# EAGLE design power-distribution (EAGLE 8.6.1)
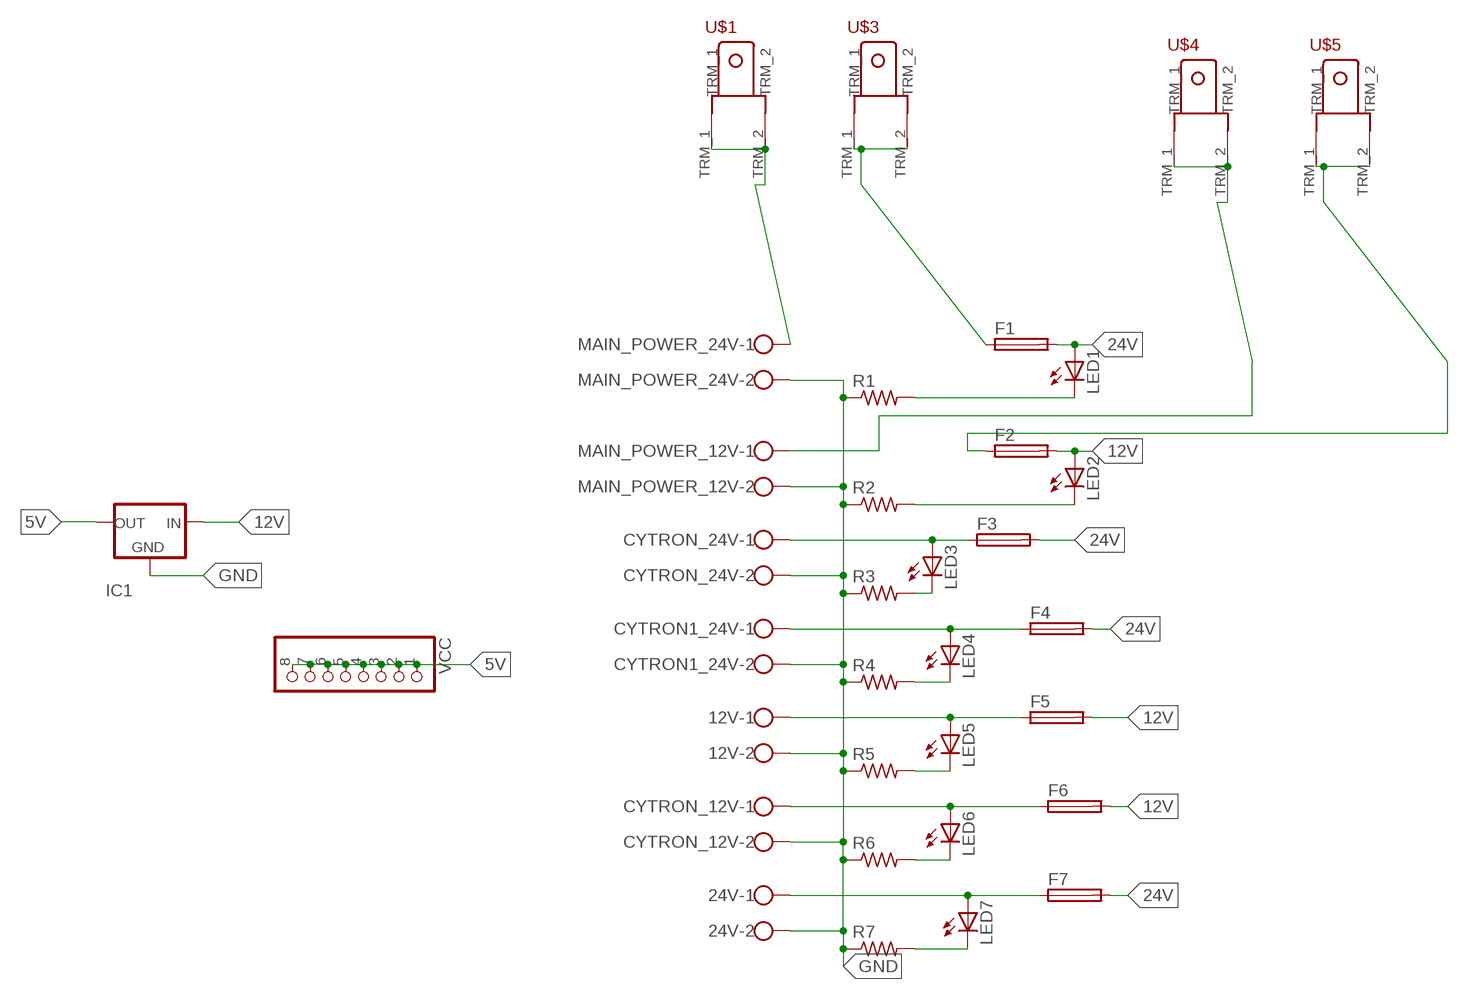
[diagram p0: schematic, sheet 1]

## Parts
12V  W237-113  [W237-113]
24V  W237-113  [W237-113]
CYTRON1_24V  W237-113  [W237-113]
CYTRON_12V  W237-113  [W237-113]
CYTRON_24V  W237-113  [W237-113]
F1  SH22,5A  [SH22,5A]
F2  SH22,5A  [SH22,5A]
F3  SH22,5A  [SH22,5A]
F4  SH22,5A  [SH22,5A]
F5  SH22,5A  [SH22,5A]
F6  SH22,5A  [SH22,5A]
F7  SH22,5A  [SH22,5A]
IC1  79XX-TO3  [TO3-79]
LED1  LED5MM  [LED5MM]
LED2  LED5MM  [LED5MM]
LED3  LED3MM  [LED3MM]
LED4  LED3MM  [LED3MM]
LED5  LED3MM  [LED3MM]
LED6  LED3MM  [LED3MM]
LED7  LED3MM  [LED3MM]
MAIN_POWER_12V  W237-113  [W237-113]
MAIN_POWER_24V  W237-113  [W237-113]
R1  R-US_0204/5  [0204/5]
R2  R-US_0207/12  [0207/12]
R3  R-US_0204/5  [0204/5]
R4  R-US_0204/5  [0204/5]
R5  R-US_0207/10  [0207/10]
R6  R-US_0204/5  [0204/5]
R7  R-US_0204/5  [0204/5]
U$1  TERMINAL_EDITED  [TERMINAL_EDITED]
U$3  TERMINAL_EDITED  [TERMINAL_EDITED]
U$4  TERMINAL_EDITED  [TERMINAL_EDITED]
U$5  TERMINAL_EDITED  [TERMINAL_EDITED]
VCC  PINHD-1X8  [1X08]

## Nets
5V: IC1.1(OUT) VCC.1 VCC.2 VCC.3 VCC.4 VCC.5 VCC.6 VCC.7 VCC.8
12V: F2.2 F5.2 F6.2 IC1.3(IN) LED2.A
24V: F1.2 F3.2 F4.2 F7.2 LED1.A
GND: 12V.2 24V.2 CYTRON1_24V.2 CYTRON_12V.2 CYTRON_24V.2 IC1.2(GND) MAIN_POWER_12V.2 MAIN_POWER_24V.2 R1.1 R2.1 R3.1 R4.1 R5.1 R6.1 R7.1
N$1: CYTRON_12V.1 F6.1 LED6.A
N$2: LED1.K(C) R1.2
N$3: MAIN_POWER_24V.1 U$1.TRM_1 U$1.TRM_2
N$4: LED2.K(C) R2.2
N$5: MAIN_POWER_12V.1 U$4.TRM_1 U$4.TRM_2
N$6: 24V.1 F7.1 LED7.A
N$7: CYTRON_24V.1 F3.1 LED3.A
N$8: LED3.K(C) R3.2
N$9: CYTRON1_24V.1 F4.1 LED4.A
N$10: LED4.K(C) R4.2
N$11: 12V.1 F5.1 LED5.A
N$12: LED5.K(C) R5.2
N$13: F1.1 U$3.TRM_1 U$3.TRM_2
N$14: F2.1 U$5.TRM_1 U$5.TRM_2
N$15: LED6.K(C) R6.2
N$16: LED7.K(C) R7.2

## Library data of the parts
12V 24V CYTRON1_24V CYTRON_12V CYTRON_24V MAIN_POWER_12V MAIN_POWER_24V = con-wago-500:W237-113: WAGO SCREW CLAMP; OC_FARNELL: unknown; OC_NEWARK: unknown
F1-F7 = fuse:SH22,5A: FUSE HOLDER grid 22,5mm, isolated cap OGN0031 8201, Schurter (Buerklin); MPN: 0031.7701.11; OC_FARNELL: unknown; OC_NEWARK: 04F1224
IC1 = v-reg:79XX-TO3: VOLTAGE REGULATOR
LED1-LED7 = led:LED: LED OSRAM: - CHIPLED LG R971, LG N971, LY N971, LG Q971, LY Q971, LO R971, LY R971 LH N974, LH R974 LS Q976, LO Q976, LY Q976 LO Q996 - Hyper CHIPLED LW Q18S LB Q993, LB Q99A, LB R99A - SideLED LS A670, LO A670, LY A670, LG A670, LP A670 LB A673, LV A673, LT A673, LW A673 LH A674 LY A675 LS A676, LA A676, LO A676, LY A676, LW A676 LS A679, LY A679, LG A679 - Hyper Micro SIDELED® LS Y876, LA Y876, LO Y876, LY Y876 LT Y87S - SmartLED LW L88C, LW L88S LB L89C, LB L89S, LG L890 LS L89K, LO L89K, LY L89K LS L896, LA L896, LO L896, LY L896 - TOPLED LS T670, LO T670, LY T670, LG T670, LP T670 LSG T670, LSP T670, LSY T670, LOP T670, LYG T670 LG T671, LOG T671, LSG T671 LB T673, LV T673, LT T673, LW T673 LH T674 LS T676, LA T676, LO T676, LY T676, LB T676, LH T676, LSB T676, LW T676 LB T67C, LV T67C, LT T67C, LS T67K, LO T67K, LY T67K, LW E67C LS E67B, LA E67B, LO E67B, LY E67B, LB E67C, LV E67C, LT E67C LW T67C LS T679, LY T679, LG T679 LS T770, LO T770, LY T770, LG T770, LP T770 LB T773, LV T773, LT T773, LW T773 LH T774 LS E675, LA E675, LY E675, LS T675 LS T776, LA T776, LO T776, LY T776, LB T776 LHGB T686 LT T68C, LB T68C - Hyper Mini TOPLED® LB M676 - Mini TOPLED Santana® LG M470 LS M47K, LO M47K, LY M47K Source: http://www.osram.convergy.de LUXEON: - LUMILED® LXK2-PW12-R00, LXK2-PW12-S00, LXK2-PW14-U00, LXK2-PW14-V00 LXK2-PM12-R00, LXK2-PM12-S00, LXK2-PM14-U00 LXK2-PE12-Q00, LXK2-PE12-R00, LXK2-PE12-S00, LXK2-PE14-T00, LXK2-PE14-U00 LXK2-PB12-K00, LXK2-PB12-L00, LXK2-PB12-M00, LXK2-PB14-N00, LXK2-PB14-P00, LXK2-PB14-Q00 LXK2-PR12-L00, LXK2-PR12-M00, LXK2-PR14-Q00, LXK2-PR14-R00 LXK2-PD12-Q00, LXK2-PD12-R00, LXK2-PD12-S00 LXK2-PH12-R00, LXK2-PH12-S00 LXK2-PL12-P00, LXK2-PL12-Q00, LXK2-PL12-R00 Source: www.luxeon.com KINGBRIGHT: KA-3528ASYC Source: www.kingbright.com
R1-R7 = rcl:R-US_: RESISTOR, American symbol; SPICEPREFIX: R
U$1 U$3-U$5 = 1-ROV-Components:TERMINAL_EDITED
VCC = pinhead:PINHD-1X8: PIN HEADER

## Board
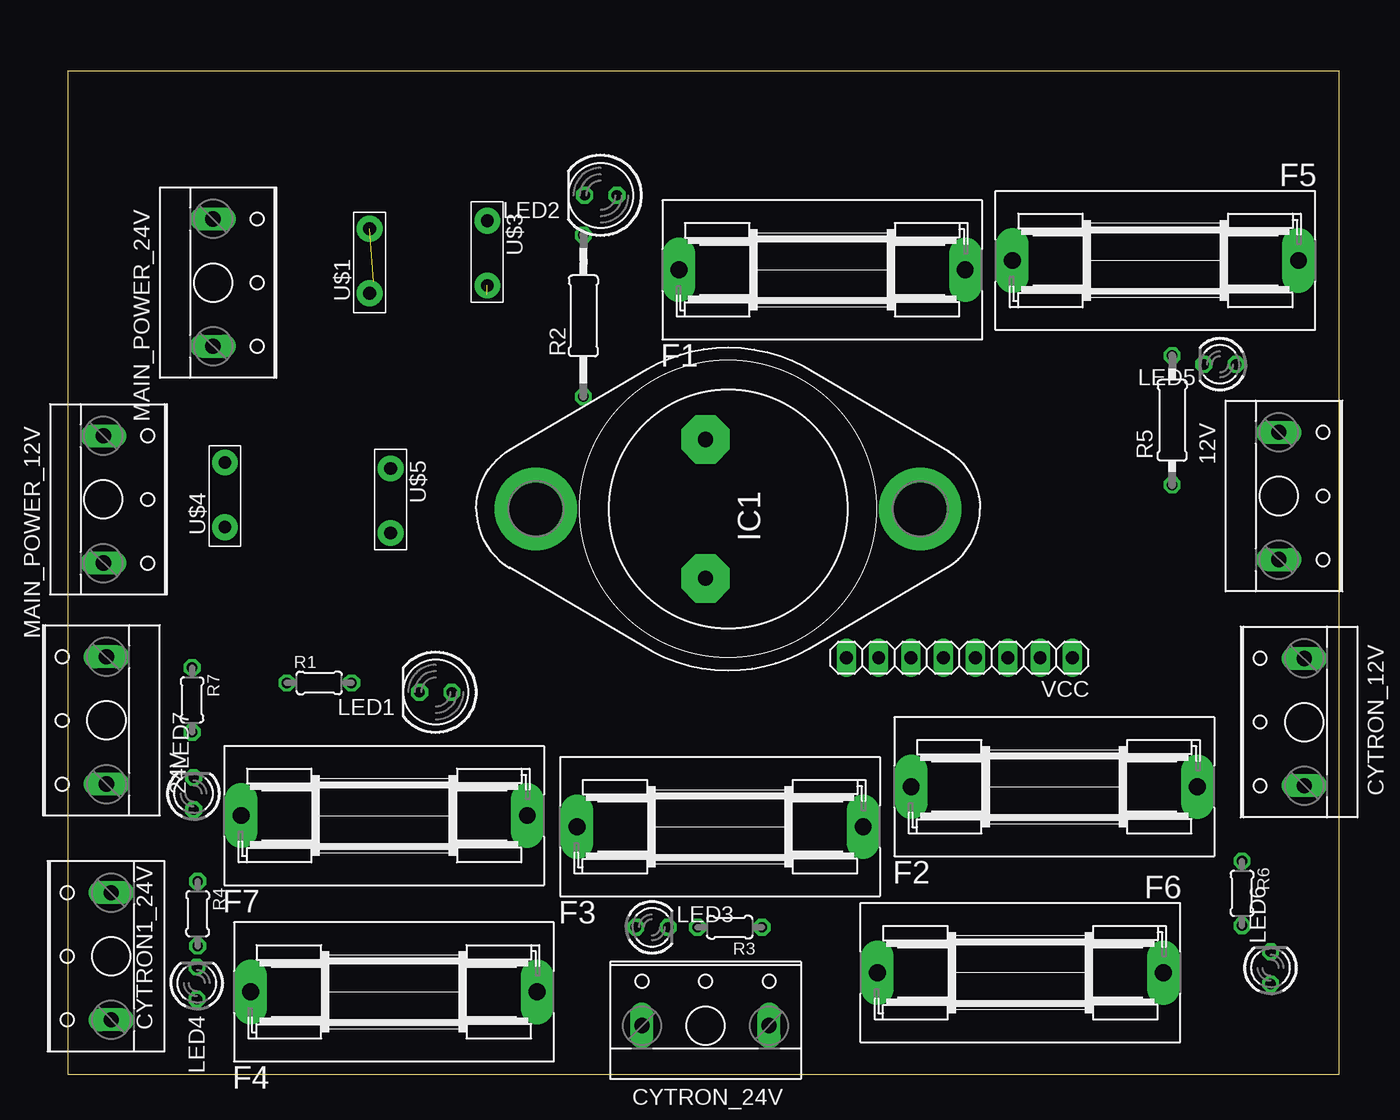
[diagram p1: board, top side]
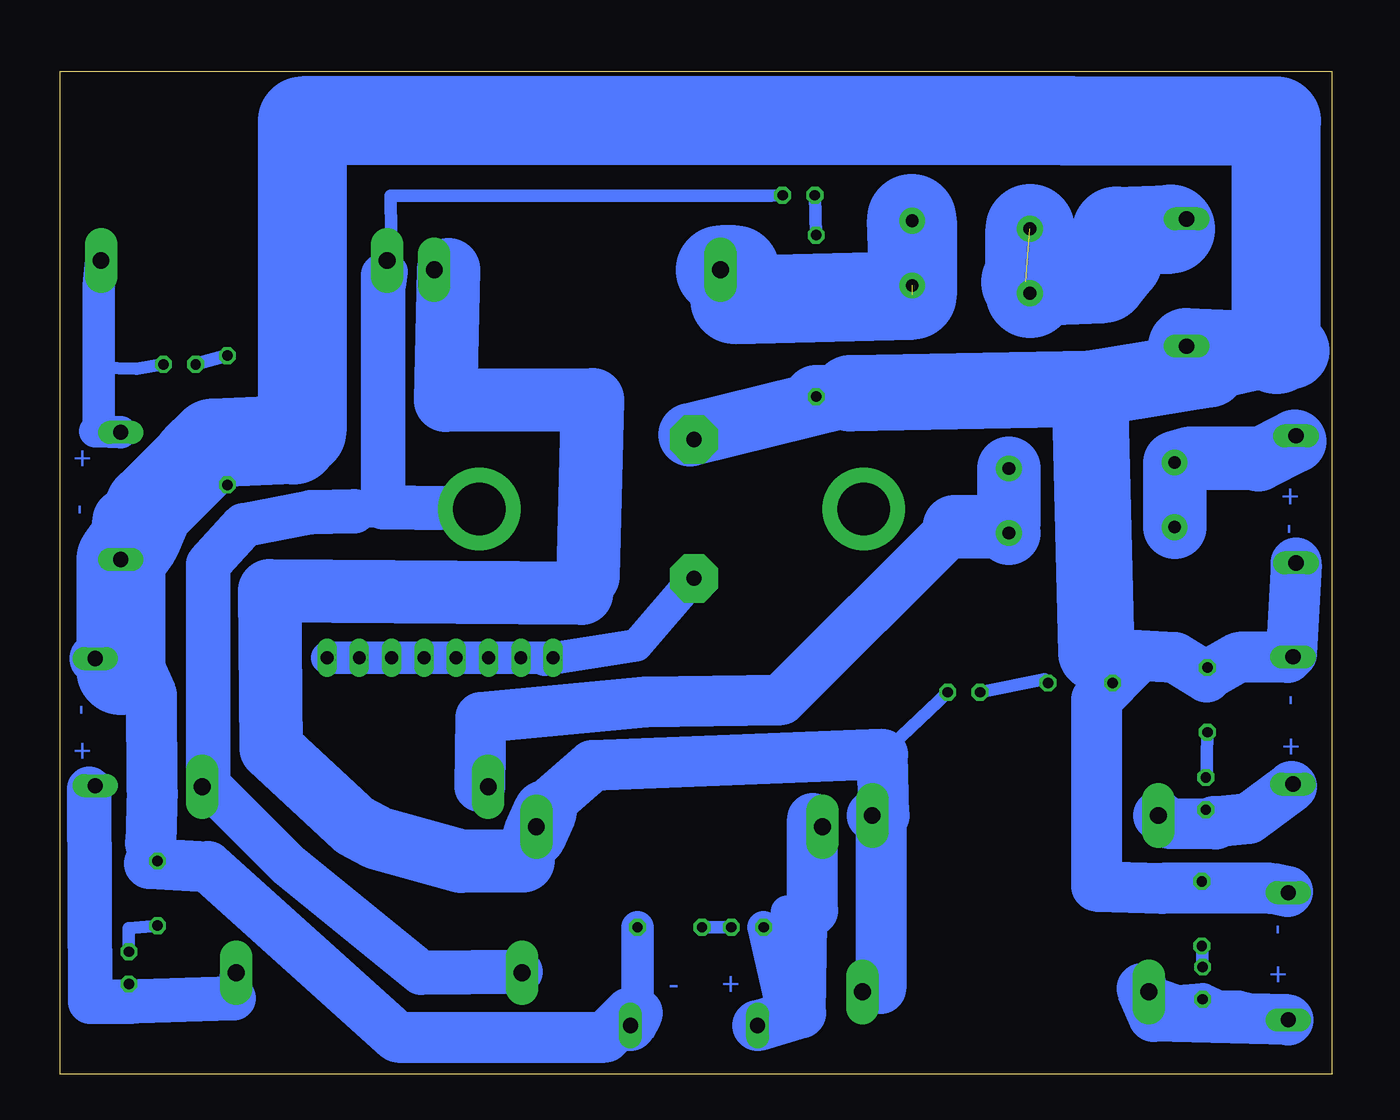
[diagram p2: board, bottom side, seen from below]

Size 100 x 78.84 mm. Coordinates in mm from the lower left corner, seen from the top.
Outline: 0,0 100,0 100,78.84 0,78.84 0,0
Copper layers (1*16): Top 0.035mm / dielectric 1.5mm / Bottom 0.035mm
Design rules "default *": minimum track width 1mm, minimum drill 1mm, track to track 0.6mm, track to pad 0.6mm, pad to pad 6mil, via to via 6mil, smd to smd 6mil, copper to edge 0.6mm, drill to drill 6mil, minimum pad ring 10mil, minimum via ring 8mil, stop-mask expansion 4mil, vias tented up to drill 0mil, thermal gap 10mil

### Footprints (pad centres in the part's own frame; a part is rotated, then mirrored left to right if it is on the bottom)
W237-113 = drill 1.194 long: 1 -5,-1.27; 2 5,-1.27
SH22,5A = drill 1.321 pad 2.54 long: 1 -11.252,0; 2 11.252,0
TO3-79 = drill 1.194 pad 3.81 octagon: 1 -1.778,-5.461; 2 -1.778,5.461 | drill 4.115 pad 6.477: 3 15.113,0; 3@ -15.113,0
LED5MM = drill 0.813 octagon: A -1.27,0; K 1.27,0
LED3MM = drill 0.813 octagon: A -1.27,0; K 1.27,0
0204/5 = drill 0.813 octagon: 1 -2.54,0; 2 2.54,0
0207/12 = drill 0.813 octagon: 1 -6.35,0; 2 6.35,0
0207/10 = drill 0.813 octagon: 1 -5.08,0; 2 5.08,0
TERMINAL_EDITED = drill 1 pad 2.032: TRM_1 -2.54,0; TRM_2 2.54,0
1X08 = drill 1.016 long: 1 -8.89,0; 2 -6.35,0; 3 -3.81,0; 4 -1.27,0; 5 1.27,0; 6 3.81,0; 7 6.35,0; 8 8.89,0

### Placement (x,y rotation side)
12V  96.52,45.45 270 top
24V  1.78,27.8 90 top
CYTRON1_24V  2.16,9.25 90 top
CYTRON_12V  96,27.67 90 top
CYTRON_24V  50.16,5.08 0 top
F1  59.34,63.23 0 top
F2  77.6,22.59 0 top
F3  51.31,19.45 0 top
F4  25.65,6.46 0 top
F5  85.55,63.96 180 top
F6  74.93,7.97 180 top
F7  24.89,20.32 0 top
IC1  51.94,44.43 0 top
LED1  28.94,30.02 180 top
LED2  41.93,69.09 180 top
LED3  45.96,11.54 0 top
LED4  10.16,7.14 90 top
LED5  90.62,55.8 180 top
LED6  94.61,8.35 90 top
LED7  9.91,22.05 90 top
MAIN_POWER_12V  4.08,45.18 270 top
MAIN_POWER_24V  12.7,62.23 270 top
R1  19.78,30.75 0 top
R2  40.56,59.61 90 top
R3  52.07,11.54 180 top
R4  10.22,12.61 270 top
R5  86.87,51.4 90 top
R6  92.36,14.21 270 top
R7  9.78,29.42 270 top
U$1  23.75,63.92 90 top
U$3  33,64.54 270 top
U$4  12.37,45.54 90 top
U$5  25.39,45.07 270 top
VCC  70.14,32.73 180 top

### Tracks (layer width: path | path; a pad name or v marks a point on that pad's centre or on a via)
5V
  Bottom 1: 61.91,32.56 VCC.8
  Bottom 2.54: VCC.8 VCC.7 VCC.6 VCC.5 VCC.4 VCC.3 VCC.2 VCC.1 | IC1.1 54.67,33.7 61.91,32.56
12V
  Bottom 1: 63.82,8.03 F6.2 | 88.22,22.59 F2.2 88.39,23.16 | LED2.A 44.1,69.04 74.04,69.04 73.94,63.13 | 74.12,61.96 F5.2 | 66.94,44.23 IC1.3
  Bottom 2.54: 74.12,61.96 73.94,63.13 74.63,62.82 | 66.94,44.23 76.88,44.26
  Bottom 3.5: 63.82,8.03 71.61,7.95 82.09,16.46 88.22,22.59 | 74.63,62.82 74.63,44.55 IC1.3 | 88.39,23.16 88.39,40.08 85.57,43.16 80.33,44.16 76.88,44.26
24V
  Bottom 1: 35.34,25.13 LED1.A | 35.47,21 36.51,21 F7.2 | 61.55,21.27 F3.2 61.87,20.64 | 69.45,63.23 F1.2
  Bottom 2.54: 35.47,6.71 F4.2 | 62.72,18.78 63.63,16.78
  Bottom 4: F7.2 35.21,20.32 35.34,25.13 58.18,24.26 61.55,21.27 | 35.47,21 35.47,6.71
  Bottom 5: 69.45,63.23 69.71,52.97 58.13,53.01 58.52,39.13 59.87,37.9 59,37.79 83.53,38.01 83.42,25.62 76.85,19.54 75,18.54 68.47,16.75 63.63,16.78 | 61.87,20.64 62.72,18.78
GND
  Bottom 1: 93.73,21.95 92.79,22.4 | 92.92,18.14 R6.1 92.98,16.56 | 3.49,14.34 CYTRON1_24V.2 | 18.51,33.13 R1.1 15.56,32.43 | 9.84,31.21 R7.1 9.53,31.53 | 3.17,33.07 24V.2 3.49,32.75
  Bottom 1.016: R5.1 89.01,48.46 89.01,48.5
  Bottom 1.27: R4.1 12.79,15.14 13.34,14.61
  Bottom 2.54: 54.61,4.81 R3.1 | 55.24,4.81 CYTRON_24V.2 | 50.48,50.26 IC1.2 | 37.86,53.51 R2.1
  Bottom 4: 54.61,4.81 CYTRON_24V.2 | 92.92,18.14 92.79,22.4 92.84,29.81 95,34.61 95,32.93 CYTRON_12V.2 | 55.24,4.81 57.15,2.91 73.47,2.91 88.38,16.3 92.98,16.56 | 3.49,14.34 4.76,14.61 13.34,14.61 18.51,14.78 18.51,29.43 15.56,32.43 | 9.84,31.21 12.38,32.75 18.51,33.13 | MAIN_POWER_12V.2 3.17,33.07 | 9.53,31.53 7.3,32.75 3.49,32.75
  Bottom 5: R2.1 38.37,53.26 50.48,50.26 | 9.67,55.4 3.17,56.88 4.35,56.95 | 81,50.54 81.68,49.86 | 21,74.92 24.23,74.95 20.23,74.95 | 95,43.54 12V.2 | 95.25,31.72 95,34.61
  Bottom 6: 37.86,53.51 19.02,53.89 | 19.02,53.89 9.67,55.4 | 3.17,56.88 MAIN_POWER_24V.2 | 19.02,53.89 18.51,33.13
  Bottom 7: 81,50.54 80.98,53.7 80.98,74.95 20.23,74.95 | 81.68,49.86 87.98,49.61 89.34,48.24 89.01,48.5 92.97,44.54 93,44.54 94,42.2 12V.2 95.25,31.72 | 4.35,56.95 4.35,74.92 21,74.92
N$1
  Bottom 1: 95.12,5.7 LED6.A 94.49,5.7 | 97.75,22.41 97.87,22.67
  Bottom 2.54: 86.36,5.95 F6.1 | 97.87,22.67 CYTRON_12V.1
  Bottom 3.5: 86.36,5.95 95.12,5.7 | 97.75,22.41 97.66,5.7 95.12,5.7 | 94.49,5.7 95.12,5.7
N$2
  Bottom 1: R1.2 22.59,31.02 LED1.K
N$3  (1 unrouted)
  Bottom 1: 12.7,66.42 MAIN_POWER_24V.1
  Bottom 5: 16.81,64 16.94,66.28
  Bottom 7: 16.94,66.28 12.7,66.42 | 24.07,62.28 18,62.54 16.81,64 | U$1.TRM_1 U$1.TRM_2
N$4
  Bottom 1: LED2.K R2.2
N$5
  Bottom 4: 12.05,48.29 6.13,48.44 | MAIN_POWER_12V.1 2.9,49.77
  Bottom 5: U$4.TRM_1 U$4.TRM_2 11.14,48.44 6.13,48.44 5.76,48.31 2.9,49.77
N$6
  Bottom 1: 9.16,19.67 LED7.A 9.27,19.84 | 3.17,22.59 24V.1
  Bottom 4: 9.16,19.67 12.7,19.7 F7.1 | 3.17,22.59 6.54,20.1 9.27,19.84
N$7
  Bottom 1: 40.83,20.08 F3.1 | 42.86,12.75 LED3.A
  Bottom 2.54: LED3.A 43.18,4.81 CYTRON_24V.1 | 42.86,12.75 40.83,12.88
  Bottom 4: CYTRON_24V.1 41.78,4.81 41.66,11.92 | 40.83,12.88 40.83,20.08
N$8
  Bottom 1: R3.2 LED3.K
N$9
  Bottom 1: 14.92,6.71 F4.1
  Bottom 2.54: 14.92,6.71 12.06,5.71 LED4.A 8.84,5.3 7.3,5.3 3.49,4.49 CYTRON1_24V.1
  Bottom 4: CYTRON1_24V.1 14,4.54 14.92,6.71
N$10
  Bottom 1: R4.2 LED4.K
N$11
  Bottom 1: 97.25,50.53 96.9,55.53 94,55.44 LED5.A | 96.98,50.85 12V.1
  Bottom 2.54: 97.25,50.53 12V.1 | 96.98,50.85 96.98,61.96 F5.1
N$12
  Bottom 1.016: R5.2 LED5.K
N$13  (1 unrouted)
  Bottom 1: 46.91,63.23 46.91,62.96
  Bottom 5: 46.91,62.96 46.94,60.88
  Bottom 7: 32.99,61.24 32.99,65.04 33.05,67.28 | 46.94,60.88 32.99,61.24 | 46.91,63.23 F1.1 | U$3.TRM_1 33,61.26 32.99,61.24
N$14
  Bottom 2.54: 66.99,22.59 F2.1
  Bottom 4: 66.99,22.59 66.91,28.05 54.01,29.26 43.31,29.43 29.7,43.04
  Bottom 5: U$5.TRM_1 25.39,43.34 25.7,43.04 25.9,43.04 | U$5.TRM_2 25.9,43.04 | 25.9,43.04 29.7,43.04
N$15
  Bottom 1: LED6.K 94.61,11.48 R6.2
N$16
  Bottom 1: LED7.K 9.84,23.32 9.84,24.81 R7.2

### Text on the board
Bottom: + | + | - | - | - | - | + | + | - | + | + | -